# EAGLE design prize_delivery (EAGLE 9.6.2)
REV: 5
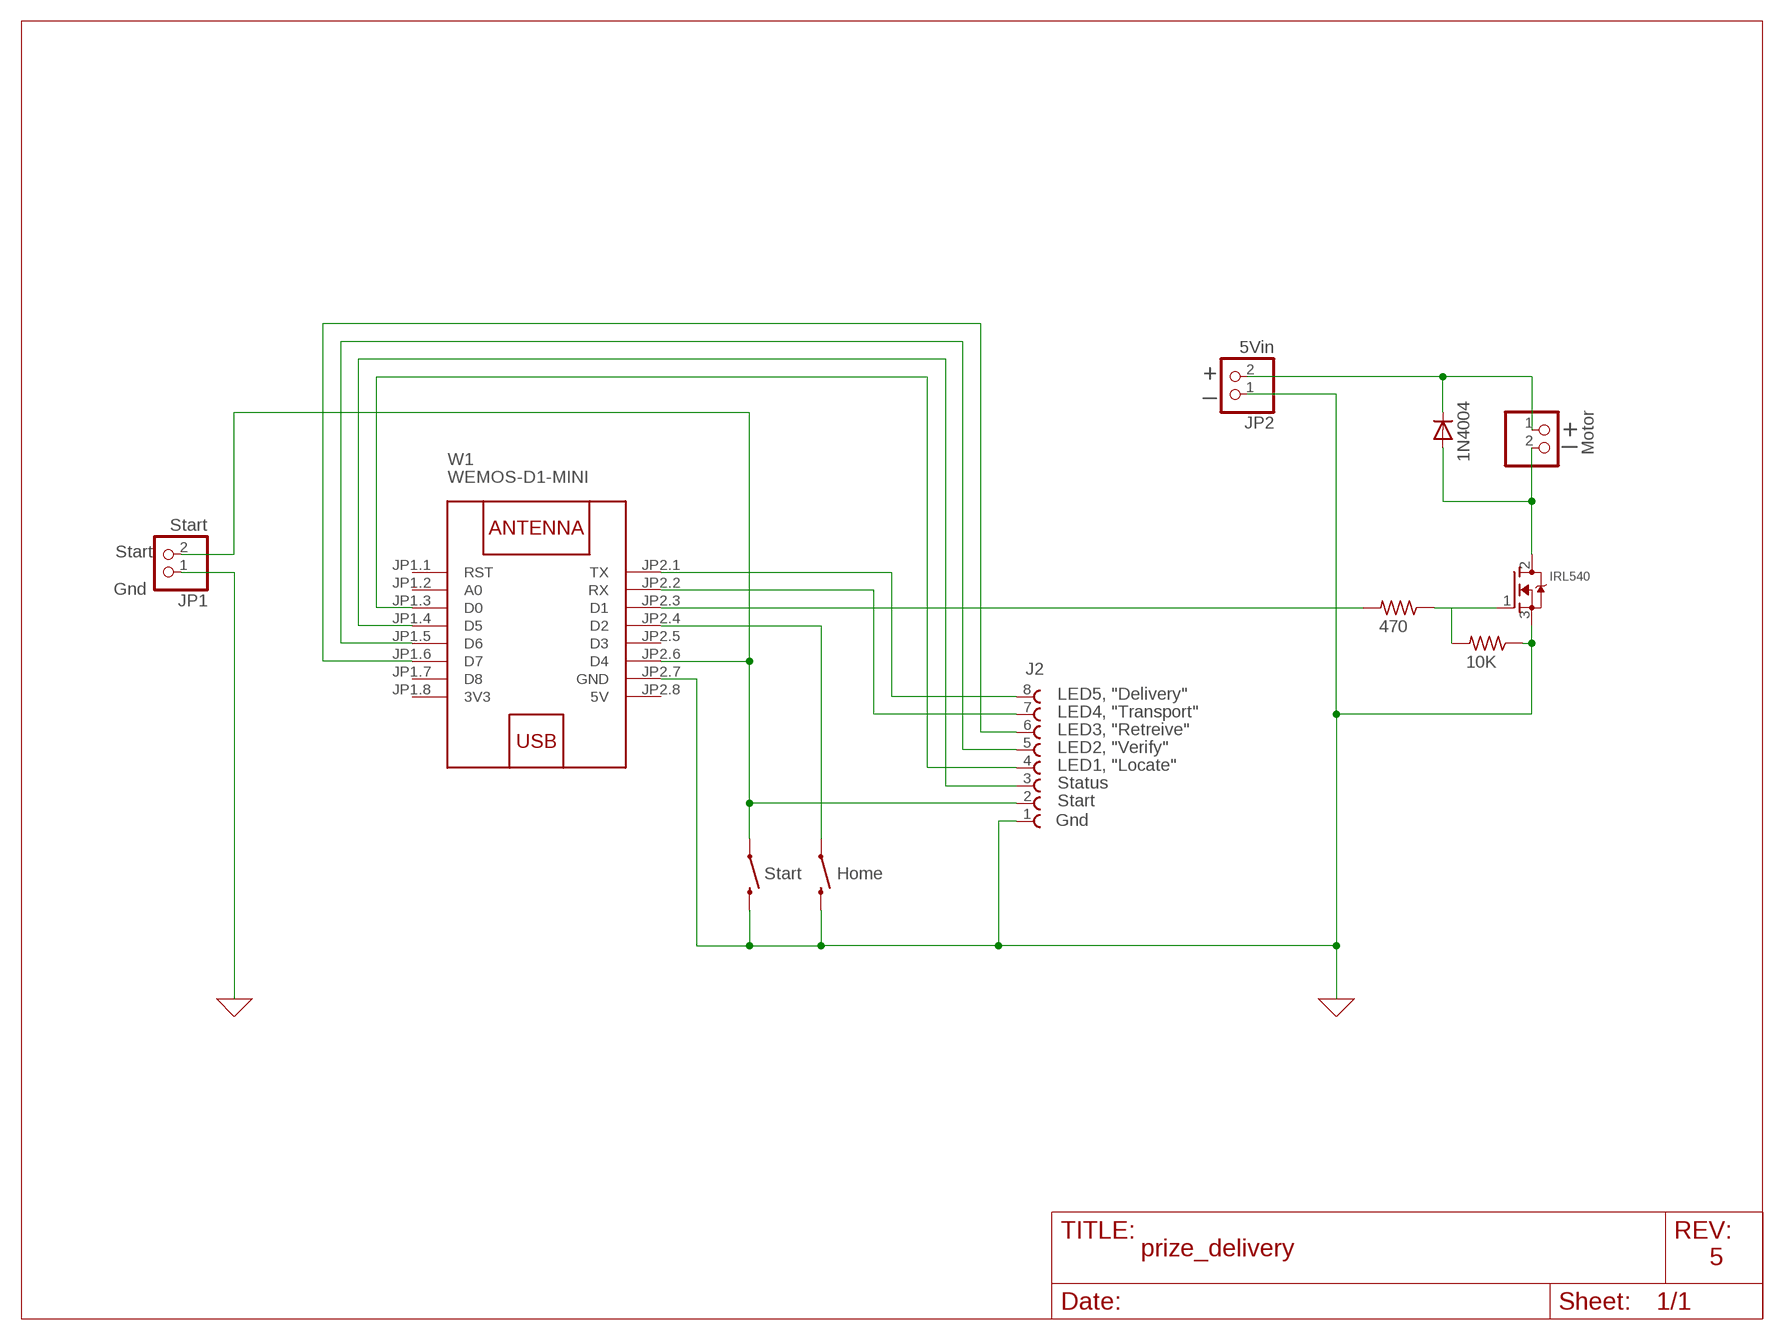
[diagram p0: schematic, sheet 1]

## Parts
360°  MOMENTARY-SWITCH-SPST-PTH-6.0MM  [TACTILE_SWITCH_PTH_6.0MM]
D1  1N4004  [DO41-10]
J2  691136710008  [691136710008]
JP1  Start  PINHD-1X2  [1X02]
JP2  5Vin  PINHD-1X2  [1X02]
JP3  Motor  PINHD-1X2  [1X02]
Q1  IRL540  MOSFET-NGDS_TO220V  [TO220V]
R2  470  R-US_0207/10  [0207/10]
R4  10K  R-US_0207/10  [0207/10]
START  MOMENTARY-SWITCH-SPST-PTH-6.0MM  [TACTILE_SWITCH_PTH_6.0MM]
W1  WEMOS-D1-MINI  [WEMOS-D1-MINI]

## Nets
0: 360°.3 J2.1 JP1.1 JP2.1 Q1.3(S) R4.1 START.3 W1.JP2.7(GND) ; supply symbol labelled GND
N$2: D1.A JP3.2 Q1.2(D)
N$3: D1.C JP2.2 JP3.1
N$5: 360°.1 W1.JP2.4(D2)
N$6: R2.2 W1.JP2.3(D1)
N$9: J2.2 JP1.2 START.1 W1.JP2.6(D4)
N$14: Q1.1(G) R2.1 R4.2
N$15: J2.4 W1.JP1.3(D0)
N$16: J2.5 W1.JP1.5(D6)
N$17: J2.6 W1.JP1.6(D7)
N$18: J2.8 W1.JP2.1(TX)
N$19: J2.7 W1.JP2.2(RX)
N$20: J2.3 W1.JP1.4(D5)
Unconnected: W1.JP1.1(RST) W1.JP1.2(A0) W1.JP1.7(D8) W1.JP2.5(D3)

## Notes on the sheet
- +
- _
- _ | +
- Start
- Gnd
- LED5, "Delivery"
- LED4, "Transport"
- LED3, "Retreive"
- LED2, "Verify"
- LED1, "Locate"
- Status
- Start
- Gnd
- Start | Home
- 5

## Power pins joined to a net without a drawn wire
3V3: W1.JP1.8(3V3)
5V: W1.JP2.8(5V)

## Library data of the parts
360° START = SparkFun-Switches:MOMENTARY-SWITCH-SPST: Momentary Switch (Pushbutton) - SPST Normally-open (NO) SPST momentary switches (buttons, pushbuttons). Variants PTH-12MM - 12mm square, through-hole Momentary Pushbutton Switch - 12mm Square <https://www.sparkfun.com/products/9190> (COM-09190) PTH-6.0MM, PTH-6.0MM-KIT - 6.0mm square, through-hole Mini Pushbutton Switch <https://www.sparkfun.com/products/97> (COM-00097) KIT package intended for soldering kit's - only one side of pads' copper is exposed. PTH-RIGHT-ANGLE-KIT - Right-angle, through-hole Right Angle Tactile Button <https://www.sparkfun.com/products/10791> - Used on SparkFun BigTime Watch Kit <https://www.sparkfun.com/products/11734> SMD-12MM - 12mm square, surface-mount Tactile Button - SMD (12mm) <https://www.sparkfun.com/products/12993> (COM-12993) Used on SparkFun PicoBoard <https://www.sparkfun.com/products/11888> SMD-4.5MM - 4.5mm Square Trackball Switch Used on SparkFun Blackberry Trackballer Breakout <https://www.sparkfun.com/products/13169> SMD-4.6MMX2.8MM - 4.60mm x 2.80mm, surface mount Used on SparkFun SAMD21 Mini Breakout <https://www.sparkfun.com/products/13664> SMD-5.2MM, SMD-5.2-REDUNDANT - 5.2mm square, surface-mount Mini Pushbutton Switch - SMD <https://www.sparkfun.com/products/8720> (COM-08720) Used on Arduino Pro Mini <https://www.sparkfun.com/products/11114> REDUNDANT package connects both switch circuits together SMD-6.0X3.5MM - 6.0 x 3.5mm, surface mount Momentary Reset Switch SMD <https://www.sparkfun.com/products/8229> (COM-08229) SMD-6.2MM-TALL - 6.2mm square, surface mount Tactile Button - SMD (6mm) <https://www.sparkfun.com/products/12992> Used on SparkFun Digital Sandbox <https://www.sparkfun.com/products/12651> SMD-RIGHT-ANGLE - Right-angle, surface mount Used on SparkFun Block for Intel® Edison - Arduino <https://www.sparkfun.com/products/13036>; PROD_ID: SWCH-08441; SF_SKU: COM-00097
D1 = adafruit:1N4004: DIODE General purpose 1N400x type rectifier (With bigger pads) http://www.ladyada.net/library/pcb/eaglelibrary.html
J2 = Wurth_Elektronik_Electromechanic_Terminal_Blocks_Connectors_rev19b:691136710008: SERIE 1367 - 5.00 MM - HORIZONTAL CABLE ENTRY WITH PRESSURE CLAMP - GLOW WIRE PLASTIC - WR-TBL =>ConTBL1 691136710008 Characteristics INSULATOR:PC FLAMABILITY RATING: UL94V0 COLOR: GREY METAL HOUSING: COPPER ALLOY / Ni+Sn TERMINAL SCREW: STEEL / Zn WIRE GUARD: COPPER ALLOY / Sn OPERATING TEMPERATURE:-30°C UP TO +120°C COMPLIANCE: LEAD FREE AND ROHS ELECTRICAL UL VDE CURRENT RATING: 16A 24A WORKING VOLTAGE: 300VAC 450VAC WITHSTANDING VOLTAGE: 1,6KV 2,5KV CONTACT RESISTANCE: 20 mOhm max <http://katalog.we-online.de/media/images/v2/Family_WR-TBL_5_00_1367_HORIZONTAL_ENTRY_W_PRESSURE_CLAMP_6911367100XX.jpg> Details see: http://katalog.we-online.de/en/em/TBL_5_00_1367_HORIZONTAL_ENTRY_W_PRESSURE_CLAMP_6911367100XX 2015 (C) Wurth Elektronik
JP1-JP3 = pinhead:PINHD-1X2: PIN HEADER
Q1 = adafruit:MOSFET-N: N-Channel Mosfet 2N7002E - 60V 260mA SOT23 [Digikey: 2N7002ET1GOSTR-ND] - REEL BSH103 - 30V 850mA SOT23 [Digikey: 568-5013-1-ND]
R2 R4 = adafruit:R-US_: RESISTOR, American symbol
W1 = diy-modules:WEMOS-D1-MINI: WEMOS D1 mini: Mini Wi-Fi Board based on ESP-8266 device More details can be found here: https://www.wemos.cc/product/d1-mini.html Click here to find device on ebay.com <http://www.ebay.com/sch/wemos+d1+mini+nodemcu>

## Board
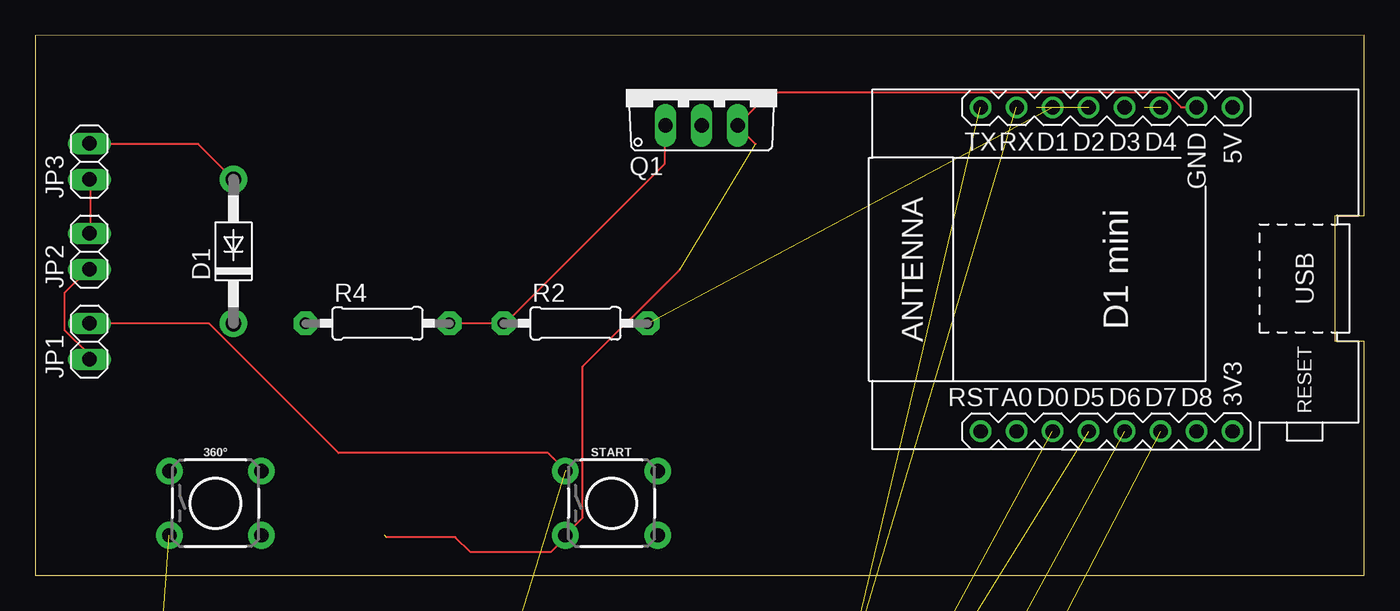
[diagram p1: board, top side]
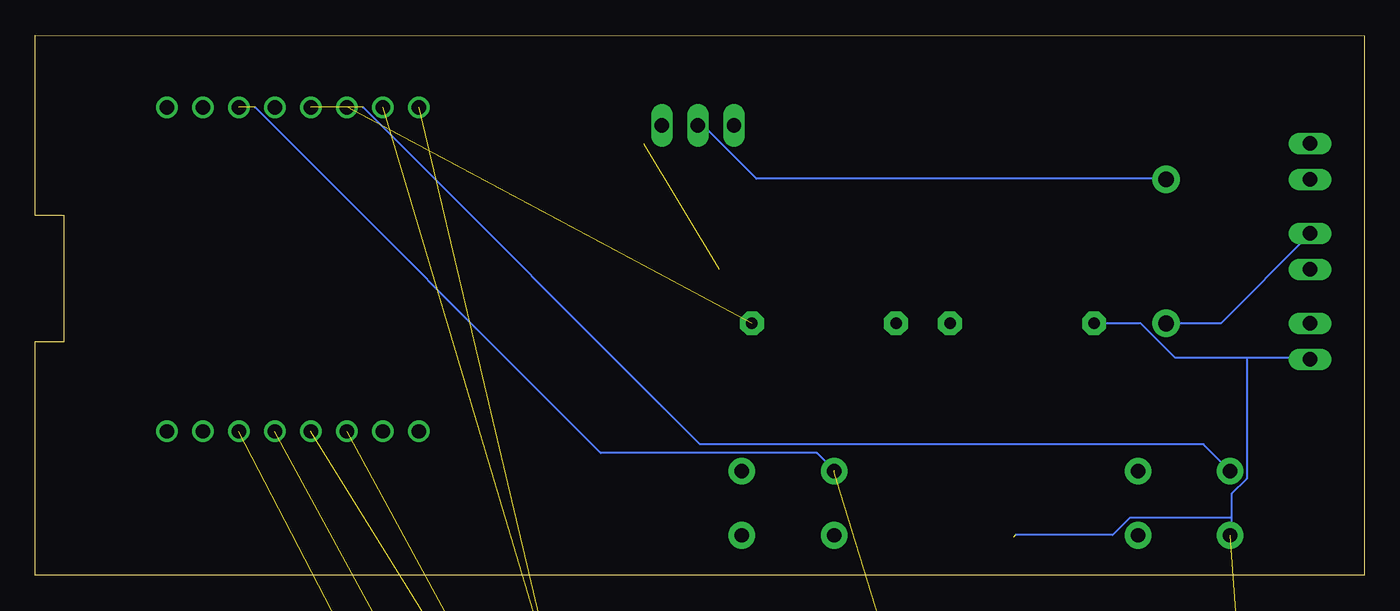
[diagram p2: board, bottom side, seen from below]

Size 93.73 x 38.1 mm. Coordinates in mm from the lower left corner, seen from the top.
Outline: 0,0 93.73,0 93.73,16.51 91.69,16.51 91.69,25.4 93.73,25.4 93.73,38.1 0,38.09 0,0
Copper layers (1*16): Top 0.035mm / dielectric 1.5mm / Bottom 0.035mm
Design rules "default": minimum track width 6mil, minimum drill 0.35mm, track to track 6mil, track to pad 6mil, pad to pad 6mil, via to via 6mil, smd to smd 6mil, copper to edge 40mil, drill to drill 6mil, minimum pad ring 10mil, minimum via ring 8mil, stop-mask expansion 4mil, vias tented up to drill 0mil, thermal gap 10mil

### Footprints (pad centres in the part's own frame; a part is rotated, then mirrored left to right if it is on the bottom)
TACTILE_SWITCH_PTH_6.0MM = drill 1.016 pad 1.88: 1 -3.251,2.261; 2 3.251,2.261; 3 -3.251,-2.261; 4 3.251,-2.261
DO41-10 = drill 1.118 pad 1.93: A 5.08,0; C -5.08,0
691136710008 = drill 1.3: 1 -17.5,0; 2 -12.5,0; 3 -7.5,0; 4 -2.5,0; 5 2.5,0; 6 7.5,0; 7 12.5,0; 8 17.5,0
1X02 = drill 1.016 long: 1 -1.27,0; 2 1.27,0
TO220V = drill 1.016 long: 1 -2.54,-2.54; 2 0,-2.54; 3 2.54,-2.54
0207/10 = drill 0.813 pad 1.676 octagon: 1 -5.08,0; 2 5.08,0
WEMOS-D1-MINI = drill 1: JP1.1 -11.43,9.525; JP1.2 -11.43,6.985; JP1.3 -11.43,4.445; JP1.4 -11.43,1.905; JP1.5 -11.43,-0.635; JP1.6 -11.43,-3.175; JP1.7 -11.43,-5.715; JP1.8 -11.43,-8.255; JP2.1 11.43,9.525; JP2.2 11.43,6.985; JP2.3 11.43,4.445; JP2.4 11.43,1.905; JP2.5 11.43,-0.635; JP2.6 11.43,-3.175; JP2.7 11.43,-5.715; JP2.8 11.43,-8.255

### Placement (x,y rotation side)
360°  12.7,5.08 0 top
D1  13.97,22.86 90 top
J2  20.32,-89.15 0 top  (outside the outline)
JP1  3.81,16.51 90 top
JP2  3.81,22.86 90 top
JP3  3.81,29.21 90 top
Q1  46.99,34.29 0 top
R2  38.1,17.78 0 top
R4  24.13,17.78 0 top
START  40.64,5.08 0 top
W1  76.2,21.59 90 top

### Tracks (layer width: path | path; a pad name or v marks a point on that pad's centre or on a via)
0  (3 unrouted)
  Top 0.152: W1.JP2.7 80.82,33.02 79.76,34.09 51.87,34.09 Q1.3 49.58,31.65 50.8,30.43 | 24.74,2.69 29.62,2.69 30.68,1.63 36.32,1.63 37.39,2.69 START.3 37.39,2.85 38.61,4.06 38.61,14.73 45.47,21.59 | JP1.1 3.71,15.34 3.71,15.65 2.03,17.32 2.03,19.91 3.71,21.59 JP2.1
  Bottom 0.152: R4.1 15.75,17.78 13.31,15.34 8.28,15.34 | 8.28,15.34 3.86,15.34 JP1.1 | 9.35,4.06 9.35,5.74 8.28,6.81 8.28,15.34 | 9.35,4.06 9.35,2.85 360°.3 | 24.59,2.85 17.73,2.85 16.51,4.06 9.35,4.06
N$2
  Top 0.152: D1.A 11.48,30.43 3.86,30.43 JP3.2
  Bottom 0.152: Q1.2 46.99,31.65 46.53,31.65 42.88,27.99 14.07,27.99 D1.A
N$3
  Top 0.152: JP2.2 3.86,24.18 3.86,27.84 JP3.1
  Bottom 0.152: D1.C 10.11,17.78 3.86,24.03 JP2.2
N$5  (1 unrouted)
  Bottom 0.152: 70.61,33.02 46.84,9.25 11.33,9.25 9.5,7.42 360°.1
N$6  (1 unrouted)
N$9  (3 unrouted)
  Top 0.152: JP1.2 12.24,17.78 21.39,8.64 36.17,8.64 37.39,7.42
  Bottom 0.152: 78.23,33.02 53.85,8.64 38.61,8.64 37.39,7.42 START.1
N$14
  Top 0.152: Q1.1 44.4,31.65 44.4,29.06 33.12,17.78 R2.1 R4.2
N$15  (1 unrouted)
N$16  (1 unrouted)
N$17  (1 unrouted)
N$18  (1 unrouted)
N$19  (1 unrouted)
N$20  (1 unrouted)